# Altium schematic sheet STM32_2021-02-10.schdoc
size 377 x 274 mm
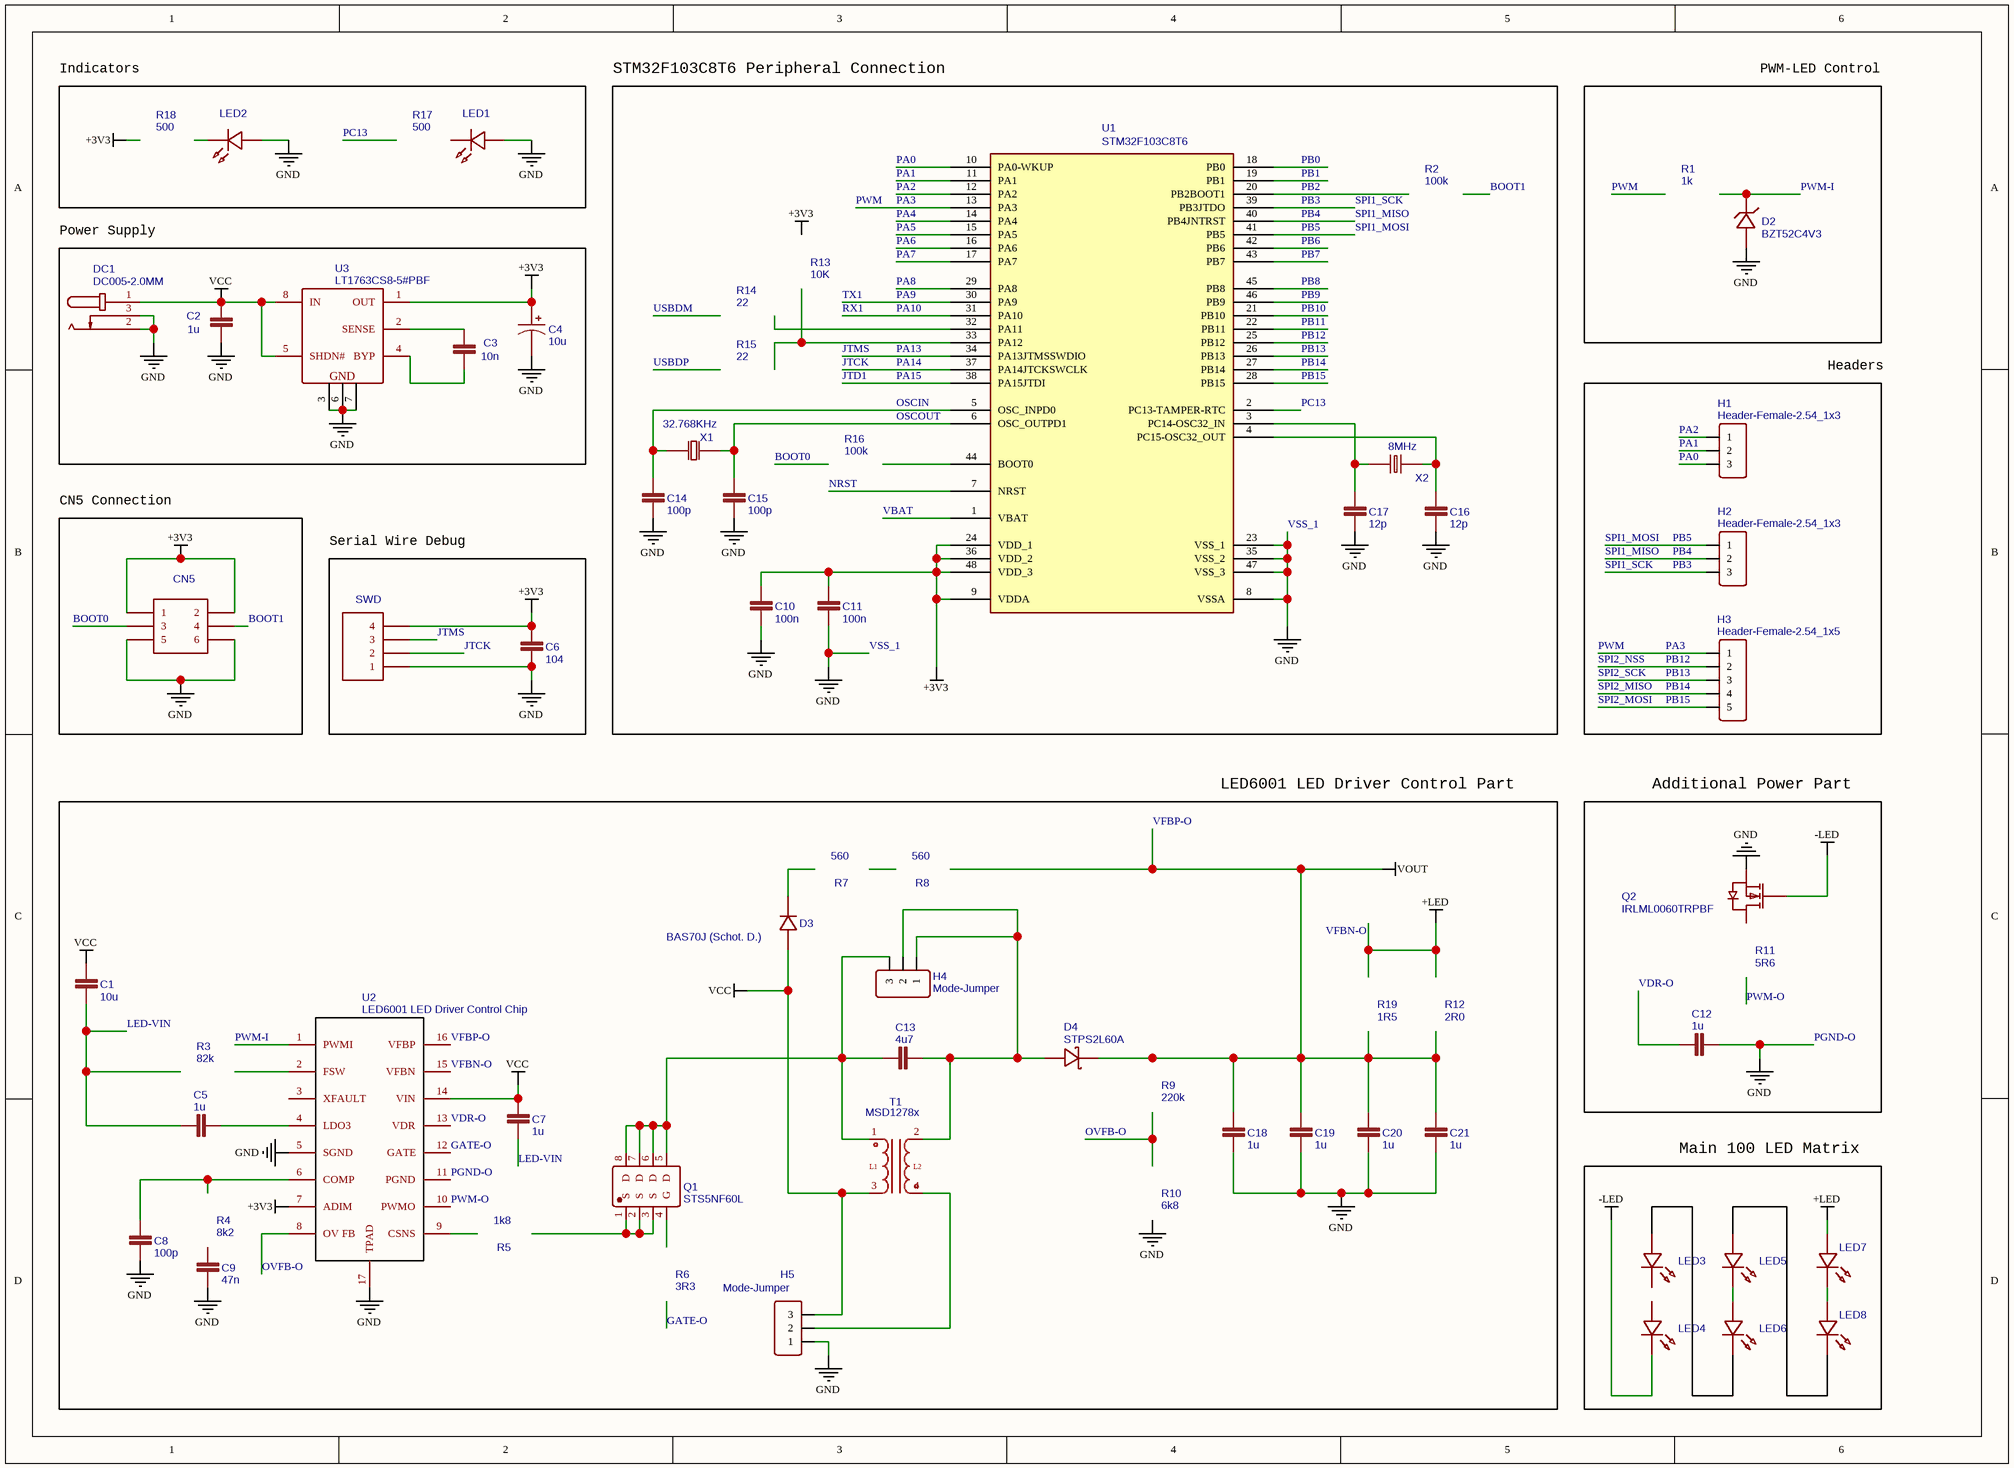
[diagram p0: STM32_2021-02-10.schdoc]

## Parts
C1  10u  [0805-CAP]
C2  1u  [0805-CAP]
C3  10n  [0805-CAP]
C4  10u  [CASE-A_3216]
C5  1u  [0805-CAP]
C6  104  [0805-CAP]
C7  1u  [0805-CAP]
C8  100p  [0805-CAP]
C9  47n  [0805-CAP]
C10  100n  [0805-CAP]
C11  100n  [0805-CAP]
C12  1u  [0805-CAP]
C13  4u7  [0805-CAP]
C14  100p  [0805-CAP]
C15  100p  [0805-CAP]
C16  12p  [0805-CAP]
C17  12p  [0805-CAP]
C18  1u  [0805-CAP]
C19  1u  [0805-CAP]
C20  1u  [0805-CAP]
C21  1u  [0805-CAP]
CN5  HDR2X3  [HDR2X3]  (value not drawn)
D2  BZT52C4V3  [SOD-123FL_L2.7-W1.8-LS3.8-RD]
D3  BAS70J (Schot. D.)  [SOD-323_L1.8-W1.3-LS2.5-RD]
D4  STPS2L60A  [SMA_L4.3-W2.6-LS5.2-RD]
DC1  DC005-2.0MM  [DC-IN-TH_DC005]
H1  Header-Female-2.54_1x3  [HDR-TH_3P-P2.54-V]
H2  Header-Female-2.54_1x3  [HDR-TH_3P-P2.54-V]
H3  Header-Female-2.54_1x5  [HDR-TH_5P-P2.54-V]
H4  Mode-Jumper  [HDR-TH_3P-P2.54-V]
H5  Mode-Jumper  [HDR-TH_3P-P2.54-V]
LED1  LED-0603_R  [LED0603_RED]  (value not drawn)
LED2  LED-0603_R  [LED0603_RED]  (value not drawn)
LED3  LED-TH-3mm_B  [LED-TH_BD3.0_BLUE]  (value not drawn)
LED4  LED-TH-3mm_B  [LED-TH_BD3.0_BLUE]  (value not drawn)
LED5  LED-TH-3mm_B  [LED-TH_BD3.0_BLUE]  (value not drawn)
LED6  LED-TH-3mm_B  [LED-TH_BD3.0_BLUE]  (value not drawn)
LED7  LED-TH-3mm_B  [LED-TH_BD3.0_BLUE]  (value not drawn)
LED8  LED-TH-3mm_B  [LED-TH_BD3.0_BLUE]  (value not drawn)
Q1  STS5NF60L  [SO-8_L4.9-W3.9-P1.27-LS5.9-BL]
Q2  IRLML0060TRPBF  [SOT-23-3_L2.9-W1.6-P1.90-LS2.8-BR]
R1  1k  [0805]
R2  100k  [0805]
R3  82k  [0805]
R4  8k2  [0805]
R5  1k8  [0805]
R6  3R3  [0805]
R7  560  [0805]
R8  560  [0805]
R9  220k  [0805]
R10  6k8  [0805]
R11  5R6  [0805]
R12  2R0  [0805]
R13  10K  [0805]
R14  22  [0805]
R15  22  [0805]
R16  100k  [0805]
R17  500  [0805]
R18  500  [0805]
R19  1R5  [0805]
SWD  SIP4  [HDR1X4]  (value not drawn)
T1  MSD1278x  [MSD12(78/60)]
U1  STM32F103C8T6  [LQFP48_N]
U2  LED6001 LED Driver Control Chip  [16-HTSSOP]
U3  LT1763CS8-5#PBF  [SO-8_L4.9-W3.9-P1.27-LS5.9-BL]
X1  32.768KHz  [OSC-SMD_L2.0-W1.2]
X2  8MHz  [OSC-SMD_L5.0-W3.2]

## Blocks framed on the sheet
Indicators: LED1 LED2 R17 R18
STM32F103C8T6 Peripheral Connection: C10 C11 C14-C17 R2 R13-R16 U1 X1 X2
PWM-LED Control: D2 R1
Power Supply: C2-C4 DC1 U3
Headers: H1-H3
CN5 Connection: CN5
Serial Wire Debug: C6 SWD
LED6001 LED Driver Control Part: C1 C5 C7-C9 C13 C18-C21 D3 D4 H4 H5 Q1 R3-R10 R12 R19 T1 U2
Additional Power Part: C12 Q2 R11
Main 100 LED Matrix: LED3-LED8

## Nets
+3V3: C4.1 C6.1 C10.1 C11.1 CN5.1 CN5.2 SWD.4 U1.9(VDDA) U1.24(VDD_1) U1.36(VDD_2) U1.48(VDD_3) U2.7(ADIM) U3.1(OUT)
-LED: LED4.2 Q2.1(G)
PGND-O: C2.2 C4.2 C6.2 C8.2 C9.2 C10.2 C11.2 C12.1 C14.1 C15.1 C16.1 C17.1 C18.2 C19.2 C20.2 C21.2 CN5.5 CN5.6 D2.2(A) DC1.2 DC1.3 H5.1 LED1.1 LED2.1 Q2.2(S) SWD.1 U1.8(VSSA) U1.23(VSS_1) U1.35(VSS_2) U1.47(VSS_3) U2.5(SGND) U2.11(PGND) U2.17(TPAD) U3.3(GND) U3.6(GND) U3.7(GND)  [also labelled GND, VSS_1]
VCC: C1.1 C2.1 C7.1 D3.2(A) DC1.1 H5.3 T1.3 U2.14(VIN) U3.5(SHDN#) U3.8(IN)
VFBN-O: LED7.1 U2.15(VFBN)  [also labelled +LED]
VFBP-O: C18.1 C19.1 C20.1 C21.1 D4.1 U2.16(VFBP)  [also labelled VOUT]
BOOT0: CN5.3
BOOT1: CN5.4
GATE-O: U2.12(GATE)
JTCK: SWD.2 U1.37(PA14JTCKSWCLK)  [also labelled PA14]
JTD1: U1.38(PA15JTDI)  [also labelled PA15]
JTMS: SWD.3 U1.34(PA13JTMSSWDIO)  [also labelled PA13]
LED-VIN: C1.2 C5.2 C7.2
NRST: U1.7(NRST)
OSCIN: C14.2 U1.5(OSC_INPD0) X1.1
OSCOUT: C15.2 U1.6(OSC_OUTPD1) X1.2
OVFB-O: U2.8(OV_FB)
PA0: H1.3 U1.10(PA0-WKUP)
PA1: H1.2 U1.11(PA1)
PA2: H1.1 U1.12(PA2)
PA3: H3.1 U1.13(PA3)  [also labelled PWM]
PA4: U1.14(PA4)
PA5: U1.15(PA5)
PA6: U1.16(PA6)
PA7: U1.17(PA7)
PA8: U1.29(PA8)
PA9: U1.30(PA9)  [also labelled TX1]
PA10: U1.31(PA10)  [also labelled RX1]
PB0: U1.18(PB0)
PB1: U1.19(PB1)
PB2: U1.20(PB2BOOT1)
PB3: H2.3 U1.39(PB3JTDO)  [also labelled SPI1_SCK]
PB4: H2.2 U1.40(PB4JNTRST)  [also labelled SPI1_MISO]
PB5: H2.1 U1.41(PB5)  [also labelled SPI1_MOSI]
PB6: U1.42(PB6)
PB7: U1.43(PB7)
PB8: U1.45(PB8)
PB9: U1.46(PB9)
PB10: U1.21(PB10)
PB11: U1.22(PB11)
PB12: H3.2 U1.25(PB12)  [also labelled SPI2_NSS]
PB13: H3.3 U1.26(PB13)  [also labelled SPI2_SCK]
PB14: H3.4 U1.27(PB14)  [also labelled SPI2_MISO]
PB15: H3.5 U1.28(PB15)  [also labelled SPI2_MOSI]
PC13: U1.2(PC13-TAMPER-RTC)
PWM-I: D2.1(K) U2.1(PWMI)
PWM-O: U2.10(PWMO)
VBAT: U1.1(VBAT)
VDR-O: C12.2 U2.13(VDR)
NetC3_1: C3.1 U3.2(SENSE)
NetC3_2: C3.2 U3.4(BYP)
NetC5_1: C5.1 U2.4(LDO3)
NetC8_1: C8.1 U2.6(COMP)
NetC13_1: C13.1 D4.2 H4.1 H4.2 T1.2
NetC13_2: C13.2 H4.3 Q1.5(D) Q1.6(D) Q1.7(D) Q1.8(D) T1.1
NetC16_2: C16.2 U1.4(PC15-OSC32_OUT) X2.2
NetC17_2: C17.2 U1.3(PC14-OSC32_IN) X2.1
NetH5_2: H5.2 T1.4
NetLED3_1: LED3.1 LED6.2
NetLED5_1: LED5.1 LED8.2
NetLED5_2: LED5.2 LED6.1
NetLED7_2: LED7.2 LED8.1
NetQ1_1: Q1.1(S) Q1.2(S) Q1.3(S)

Not connected (* = marked no-connect by the designer): C9 1; D3 1(C); LED1 2; LED2 2; LED3 2; LED4 1; Q1 4(G); Q2 3(D); U1 32(PA11) 33(PA12) 44(BOOT0); U2 2(FSW) 3(XFAULT) 9(CSNS)

## Notes on the sheet
- Labels drawn without touching a wire or pin: +3V3, GND
- (in symbol MSD1278x) L1; L2

## Library data of the parts
C1 = 10u: catid: 20; description: CAP-11625; Contributor: SparkFun; sourceId: T752omIG2; BOM_Manufacturer Part: ?; spicePre: C
C2 C5 C7 C12 C18-C21 = 1u: catid: 20; description: CAP-11625; Contributor: SparkFun; sourceId: T752omIG2; BOM_Manufacturer Part: ?; spicePre: C
C3 = 10n: catid: 20; description: CAP-11625; Contributor: SparkFun; sourceId: T752omIG2; BOM_Manufacturer Part: ?; spicePre: C
C4 = 10u: nameAlias: Value(F); Contributor: LCEDA_Lib; spicePre: C; spiceSymbolName: C_Tan_SMD_A_US
C6 = 104: catid: 20; description: CAP-11625; Contributor: SparkFun; sourceId: T752omIG2; BOM_Manufacturer Part: ?; spicePre: C
C8 C14 C15 = 100p: catid: 20; description: CAP-11625; Contributor: SparkFun; sourceId: T752omIG2; BOM_Manufacturer Part: ?; spicePre: C
C9 = 47n: catid: 20; description: CAP-11625; Contributor: SparkFun; sourceId: T752omIG2; BOM_Manufacturer Part: ?; spicePre: C
C10 C11 = 100n: catid: 20; description: CAP-11625; Contributor: SparkFun; sourceId: T752omIG2; BOM_Manufacturer Part: ?; spicePre: C
C13 = 4u7: catid: 20; description: CAP-11625; Contributor: SparkFun; sourceId: T752omIG2; BOM_Manufacturer Part: ?; spicePre: C
C16 C17 = 12p: catid: 20; description: CAP-11625; Contributor: SparkFun; sourceId: T752omIG2; BOM_Manufacturer Part: ?; spicePre: C
CN5 = HDR2X3: catid: 20; BOM_Manufacturer Part: ?; spicePre: P
D2 = BZT52C4V3: BOM_Manufacturer: Hottech; Contributor: LCSC; SMT Type: Extend; BOM_Supplier: LCSC; BOM_Manufacturer Part: BZT52C4V3; BOM_Supplier Part: C181196; BOM_JLCPCB SMD: Yes; BOM_LCSC Assembly: Yes; spicePre: D; spiceSymbolName: BZT52C4V3
D3 = BAS70J (Schot. D.): BOM_Manufacturer: CJ; BOM_Manufacturer Part: BAS70WS; SMT Type: Extend; BOM_Supplier: LCSC; BOM_Supplier Part: C77312; BOM_JLCPCB SMD: Yes; BOM_LCSC Assembly: Yes; spicePre: D; spiceSymbolName: BAS70WS
D4 = STPS2L60A: BOM_Manufacturer: STMicroelectronics; Contributor: LCSC; SMT Type: Extend; BOM_Supplier Part: C155623; BOM_Supplier: LCSC; BOM_Manufacturer Part: STPS2L60A; BOM_JLCPCB SMD: Yes; BOM_LCSC Assembly: Yes; spicePre: D; spiceSymbolName: STPS2L60A
DC1 = DC005-2.0MM: BOM_Manufacturer: SOFNG; BOM_Supplier: LCSC; BOM_Manufacturer Part: DC005-2.0MM; BOM_Supplier Part: C111567; spicePre: D; spiceSymbolName: DC005-2.0MM
H1 H2 = Header-Female-2.54_1x3: BOM_Manufacturer: Boom Precision Elec; SMT Type: Extend; BOM_Supplier Part: C146243; BOM_Supplier: LCSC; BOM_Manufacturer Part: Header-Female-2.54_1x3; link: https://datasheet.lcsc.com/szlcsc/Boom-Precision-Elec-2-54mm-1-8P-Straight-Female-header_C27438.pdf; BOM_LCSC Assembly: Yes; spicePre: P; spiceSymbolName: Header-Female-2.54_1x3
H3 = Header-Female-2.54_1x5: BOM_Manufacturer: BOOMELE; BOM_Manufacturer Part: 2.54mm 1*5p Female header; SMT Type: Extend; BOM_Supplier: LCSC; image: //image.lceda.cn/szlcsc/C50950.jpg; BOM_Supplier Part: C50950; BOM_LCSC Assembly: Yes; spicePre: H; spiceSymbolName: Header-Female-2.54_1x5
H4 H5 = Mode-Jumper: BOM_Manufacturer: Boom Precision Elec; BOM_Manufacturer Part: Header-Female-2.54_1x3; SMT Type: Extend; BOM_Supplier Part: C146243; BOM_Supplier: LCSC; link: https://datasheet.lcsc.com/szlcsc/Boom-Precision-Elec-2-54mm-1-8P-Straight-Female-header_C27438.pdf; BOM_LCSC Assembly: Yes; spicePre: P; spiceSymbolName: Header-Female-2.54_1x3
LED1 LED2 = LED-0603_R: BOM_Manufacturer: EVERLIGHT(台湾亿光); BOM_Manufacturer Part: 19-217/R6C-AL1M2VY/3T; Contributor: LCEDA_01; BOM_Supplier Part: C72044; BOM_Supplier: LCSC; spicePre: L; spiceSymbolName: LED-0603_R
LED3-LED8 = LED-TH-3mm_B: BOM_Manufacturer: EVERLIGHT(台湾亿光); BOM_Manufacturer Part: 204-10SUBC/S400-A4; Contributor: LCEDA_Lib; BOM_Supplier Part: C86881; BOM_Supplier: LCSC; spicePre: L; spiceSymbolName: LED-TH-3mm_B
Q1 = STS5NF60L: BOM_Manufacturer: STMicroelectronics; Contributor: LCSC; SMT Type: Extend; BOM_Supplier: LCSC; BOM_Supplier Part: C457490; BOM_Manufacturer Part: STS5NF60L; BOM_JLCPCB SMD: Yes; BOM_LCSC Assembly: Yes; spicePre: Q; spiceSymbolName: STS5NF60L
Q2 = IRLML0060TRPBF: BOM_Manufacturer: IR; SMT Type: Extend; BOM_Supplier: LCSC; BOM_Manufacturer Part: IRLML0060TRPBF; BOM_Supplier Part: C67274; BOM_JLCPCB SMD: Yes; spicePre: Q; spiceSymbolName: IRLML0060TRPBF
R1 = 1k: catid: 20; description: RES-09883; Contributor: SparkFun; sourceId: 6cke8qHBT; BOM_Manufacturer Part: ?; spicePre: R
R2 R16 = 100k: catid: 20; description: RES-09883; Contributor: SparkFun; sourceId: 6cke8qHBT; BOM_Manufacturer Part: ?; spicePre: R
R3 = 82k: catid: 20; description: RES-09883; Contributor: SparkFun; sourceId: 6cke8qHBT; BOM_Manufacturer Part: ?; spicePre: R
R4 = 8k2: catid: 20; description: RES-09883; Contributor: SparkFun; sourceId: 6cke8qHBT; BOM_Manufacturer Part: ?; spicePre: R
R5 = 1k8: catid: 20; description: RES-09883; Contributor: SparkFun; sourceId: 6cke8qHBT; BOM_Manufacturer Part: ?; spicePre: R
R6 = 3R3: catid: 20; description: RES-09883; Contributor: SparkFun; sourceId: 6cke8qHBT; BOM_Manufacturer Part: ?; spicePre: R
R7 R8 = 560: catid: 20; description: RES-09883; Contributor: SparkFun; sourceId: 6cke8qHBT; BOM_Manufacturer Part: ?; spicePre: R
R9 = 220k: catid: 20; description: RES-09883; Contributor: SparkFun; sourceId: 6cke8qHBT; BOM_Manufacturer Part: ?; spicePre: R
R10 = 6k8: catid: 20; description: RES-09883; Contributor: SparkFun; sourceId: 6cke8qHBT; BOM_Manufacturer Part: ?; spicePre: R
R11 = 5R6: catid: 20; description: RES-09883; Contributor: SparkFun; sourceId: 6cke8qHBT; BOM_Manufacturer Part: ?; spicePre: R
R12 = 2R0: catid: 20; description: RES-09883; Contributor: SparkFun; sourceId: 6cke8qHBT; BOM_Manufacturer Part: ?; spicePre: R
R13 = 10K: catid: 20; description: RES-09883; Contributor: SparkFun; sourceId: 6cke8qHBT; BOM_Manufacturer Part: ?; spicePre: R
R14 R15 = 22: catid: 20; description: RES-09883; Contributor: SparkFun; sourceId: 6cke8qHBT; BOM_Manufacturer Part: ?; spicePre: R
R17 R18 = 500: catid: 20; description: RES-09883; Contributor: SparkFun; sourceId: 6cke8qHBT; BOM_Manufacturer Part: ?; spicePre: R
R19 = 1R5: catid: 20; description: RES-09883; Contributor: SparkFun; sourceId: 6cke8qHBT; BOM_Manufacturer Part: ?; spicePre: R
SWD = SIP4: catid: 20; BOM_Manufacturer Part: ?; spicePre: P
T1 = MSD1278x: BOM_Manufacturer: MSD1278-564KL_; BOM_Manufacturer Part: Coilcraft; Contributor: nick10mc; BOM_Supplier: Mouser; BOM_Supplier Part: 994-MSD1278-564KLD; link: https://www.coilcraft.com/MSD1278.cfm; spicePre: T; spiceSymbolName: MSD1278-564
U1 = STM32F103C8T6: catid: 20; description: STM32 ARM-based 32-bit MCU with 64 Kbytes Flash, 48-pin LQFP, Industrial Temperature; sourceId: tCOMH7531; BOM_Manufacturer Part: ?; spicePre: U
U2 = LED6001 LED Driver Control Chip: BOM_Manufacturer: STMicroelectronics; Contributor: sparkyhf; BOM_Manufacturer Part: LED6001; BOM_Supplier: Digi-Key; BOM_Supplier Part: 497-16181-5-ND; link: https://www.digikey.com/product-detail/en/stmicroelectronics/LED6001/497-16181-5-ND/4841805; spicePre: U; spiceSymbolName: LED6001 LED Driver Control Chip
U3 = LT1763CS8-5#PBF: BOM_Manufacturer: LINEAR; BOM_Supplier: LCSC; BOM_Manufacturer Part: LT1763CS8-5#PBF; BOM_Supplier Part: C117275; spicePre: U; spiceSymbolName: LT1763CS8-5#PBF
X1 = 32.768KHz: BOM_Manufacturer: SEIKO; BOM_Manufacturer Part: SC-20S32.768kHz20PPM12.5pF; nameAlias: Frequency; BOM_Supplier: LCSC; BOM_Supplier Part: C97607; spicePre: X; spiceSymbolName: SC-20S32.768kHz20PPM12.5pF
X2 = 8MHz: BOM_Manufacturer: Harmony Elec; BOM_Manufacturer Part: X5H008000FF1H; nameAlias: Frequency; Contributor: LCSC; BOM_Supplier: LCSC; BOM_Supplier Part: C254389; spicePre: X; spiceSymbolName: X5H008000FF1H